# Altium schematic sheet Communications_Module.SchDoc: Communications Modules
size A3; DrawnBy: Igor Bubanja, Tim Oorschot; Organization: Group 7; Address1: ECE Department; Address2: University of Canterbury; Address3: Christchurch 8041; Address4: New Zealand; Revision: 1; SheetNumber: 3; SheetTotal: 3
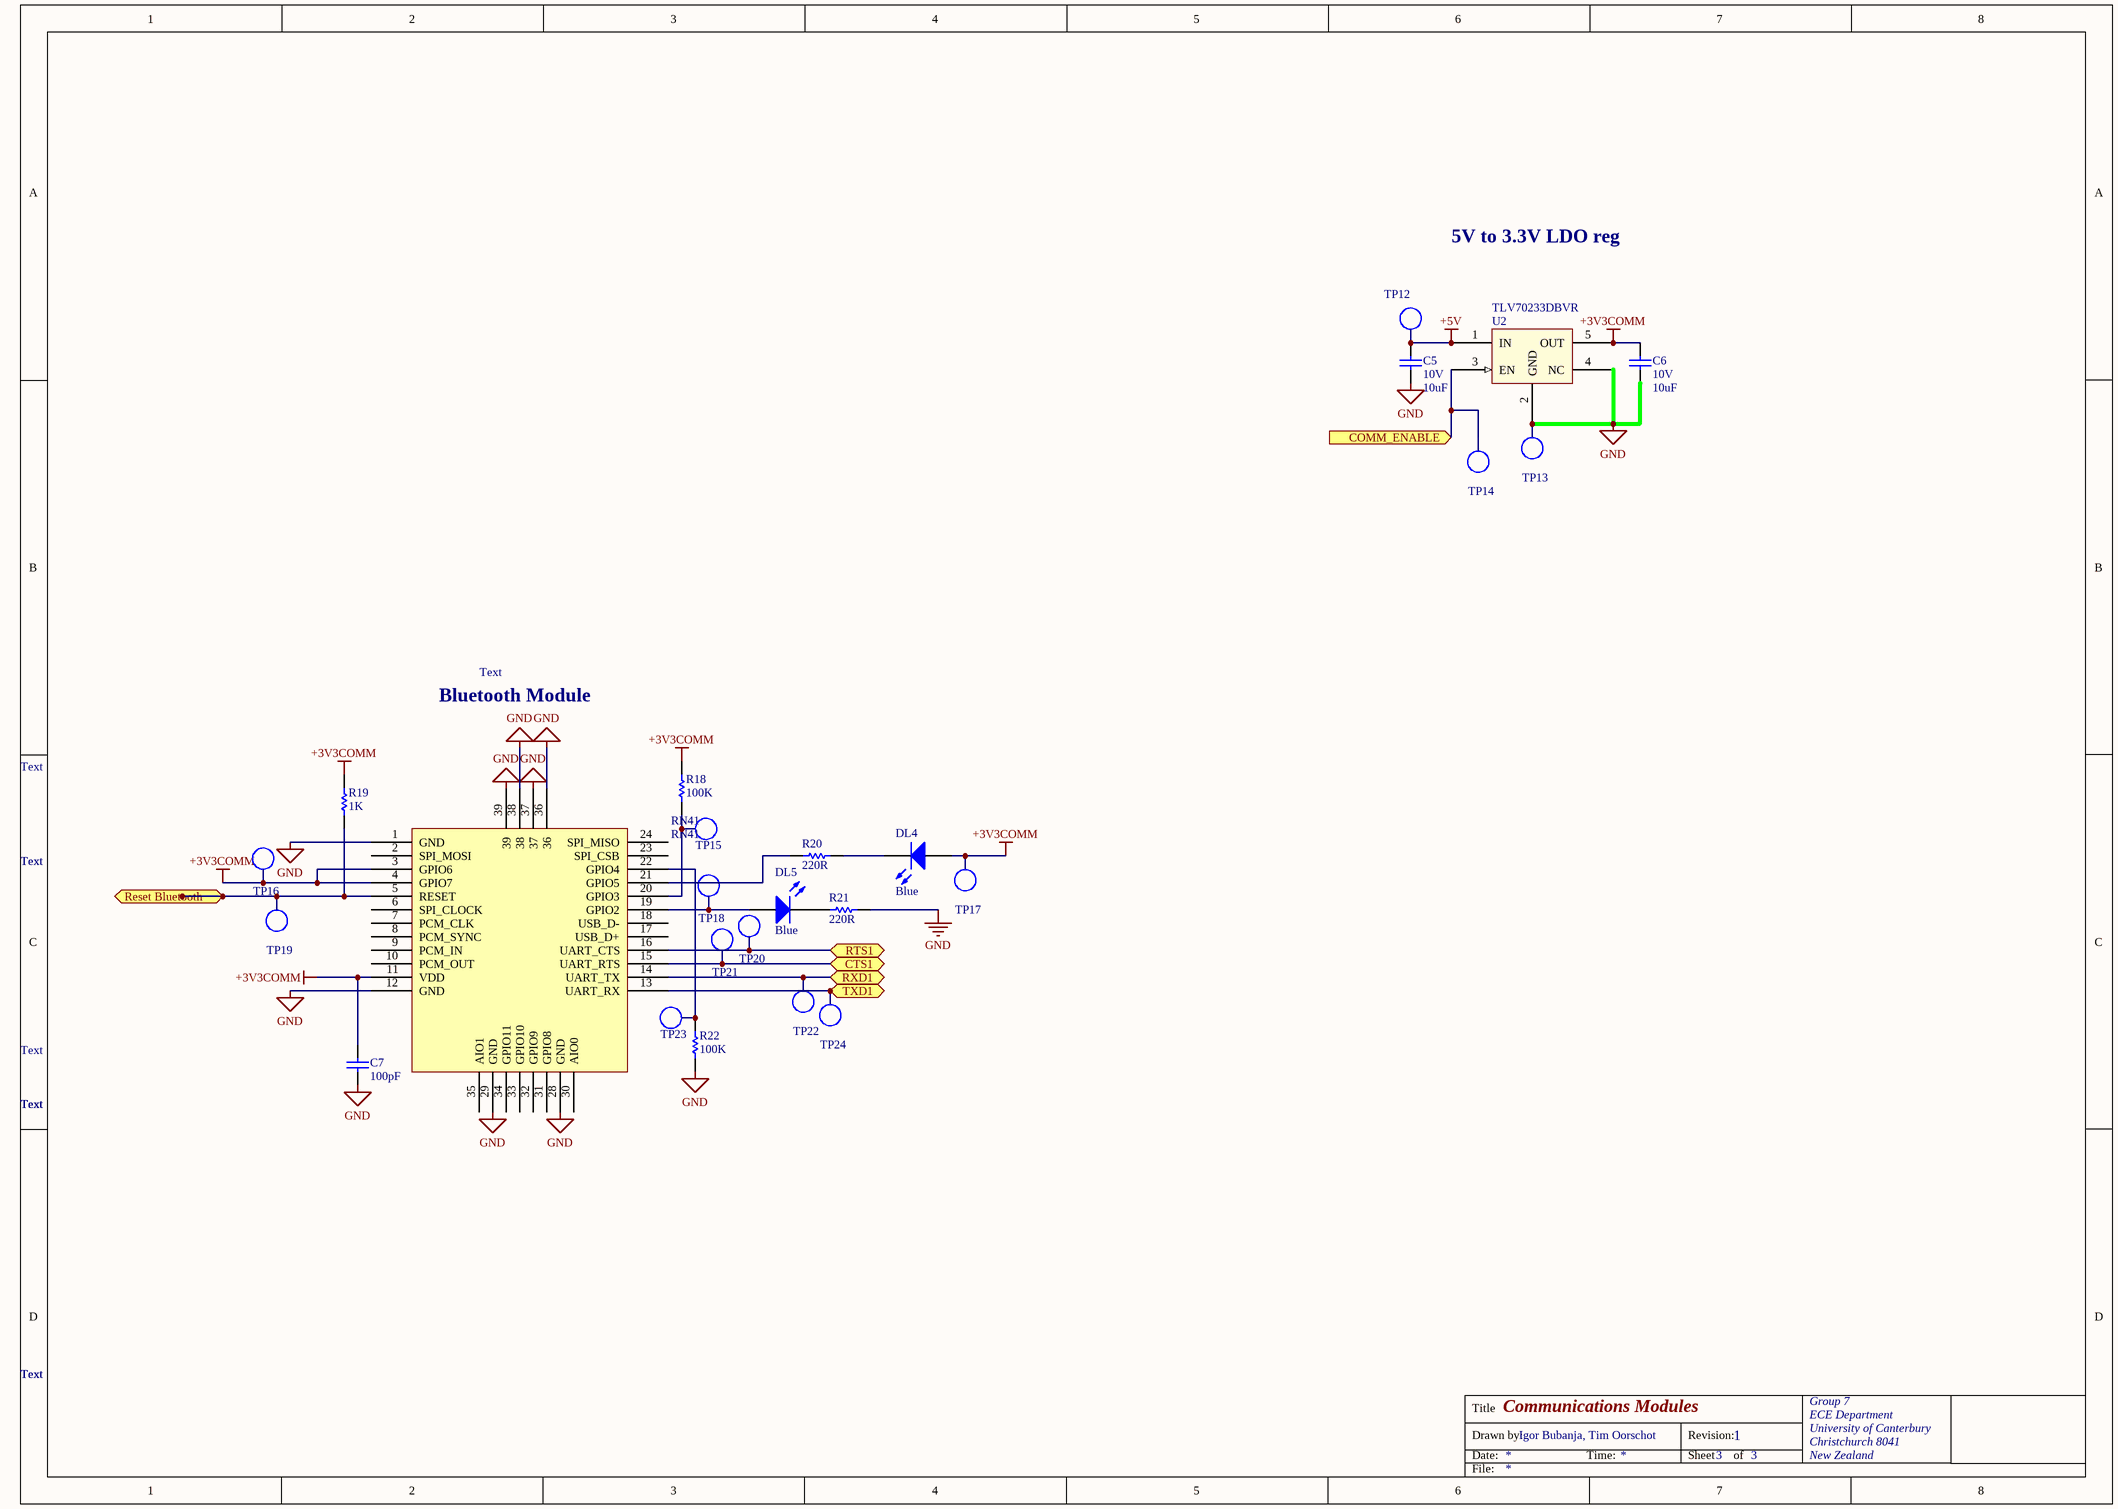
[diagram p0: Communications_Module.SchDoc]

## Parts
C5  Voltage - Rated: 10V  [CAPC1608L]  (hidden comment: 10uF)
C6  Voltage - Rated: 10V  [CAPC1608L]  (hidden comment: 10uF)
C7  100pF  [CAPC1608L]
DL4  Blue  [WL-SMCW0603]
DL5  Blue  [WL-SMCW0603]
R18  100K  [RESC1608L]
R19  1K  [RESC1608L]
R20  220R  [RESC1608L]
R21  220R  [RESC1608L]
R22  100K  [RESC1608L]
RN41  RN41  [PCBComponent_1]
TP12  V_Bus  [TP_0805]  (value not drawn)
TP13  Gnd  [TP_0805]  (value not drawn)
TP14  Gnd  [TP_0805]  (value not drawn)
TP15  Gnd  [TP_0805]  (value not drawn)
TP16  Gnd  [TP_0805]  (value not drawn)
TP17  Gnd  [TP_0805]  (value not drawn)
TP18  Gnd  [TP_0805]  (value not drawn)
TP19  Gnd  [TP_0805]  (value not drawn)
TP20  Gnd  [TP_0805]  (value not drawn)
TP21  Gnd  [TP_0805]  (value not drawn)
TP22  Gnd  [TP_0805]  (value not drawn)
TP23  Gnd  [TP_0805]  (value not drawn)
TP24  Gnd  [TP_0805]  (value not drawn)
U2  TLV70233DBVR  [SOT95P280X145-5N]

## Ports
COMM_ENABLE (in), CTS1, Reset Bluetooth, RTS1, RXD1, TXD1

## Nets
+3V3COMM: C6.1 C7.2 DL4.2(A) R18.2 R19.2 RN41.3(GPIO6) RN41.4(GPIO7) RN41.11(VDD) TP16.1(TP) TP17.1(TP) U2.5(OUT)
+5V: C5.1 TP12.1(TP) U2.1(IN)
GND: C5.2 C6.2 C7.1 R21.2 R22.1 RN41.1(GND) RN41.12(GND) RN41.28(GND) RN41.29(GND) RN41.36 RN41.37 RN41.38 RN41.39 TP13.1(TP) U2.2(GND) U2.4(NC)
COMM_ENABLE: TP14.1(TP) U2.3(EN) ; port COMM_ENABLE
CTS1: RN41.15(UART_RTS) TP21.1(TP) ; port CTS1
Reset Bluetooth: R19.1 RN41.5(RESET) TP19.1(TP) ; port Reset Bluetooth
RTS1: RN41.16(UART_CTS) TP20.1(TP) ; port RTS1
RXD1: RN41.14(UART_TX) TP22.1(TP) ; port RXD1
TXD1: RN41.13(UART_RX) TP24.1(TP) ; port TXD1
NetDL4_1: DL4.1(K) R20.2
NetDL5_1: DL5.1(K) R21.1
NetDL5_2: DL5.2(A) RN41.19(GPIO2) TP18.1(TP)
NetR18_1: R18.1 RN41.20(GPIO3) TP15.1(TP)
NetR20_1: R20.1 RN41.21(GPIO5)
NetR22_2: R22.2 RN41.22(GPIO4) TP23.1(TP)

Not connected (* = marked no-connect by the designer): RN41 2(SPI_MOSI) 6(SPI_CLOCK) 7(PCM_CLK) 8(PCM_SYNC) 9(PCM_IN) 10(PCM_OUT) 17(USB_D+) 18(USB_D-) 23(SPI_CSB) 24(SPI_MISO) 30(AIO0) 31(GPIO8) 32(GPIO9) 33(GPIO10) 34(GPIO11) 35(AIO1)

## Notes on the sheet
- 5V to 3.3V LDO reg
- Bluetooth Module
- Text
- Title
- Drawn by:
- Date:
- Time:
- Revision:
- Sheet
- of
- File:

## Library data of the parts
C5 C6 = CC_10uF_0603: CAP CER 10UF X5R +-20% 10V 0603; Supplier: ECE Dept; Storage Location: PCB Assembly WS; Value: 10uF
C7 = CC_100pF_0603: CAP CER 100pF NPO/COG +-5% 50V 0603; PackageReference: 0603; Code_IPC: 1608 [0603]; Verify: *; Supplier: ECE Dept; Storage Location: PCB Assembly WS; Value: 100pF
DL4 DL5 = DL_150060BS75000: LED Blue 270mcd 0603 SMD; Manufacturer: WURTH ELEKTRONIK; Forward Current If: 30; Forward Voltage: 3.2; Luminous Intensity: 270; Viewing Angle: 120°; Wavelength Typ: 470; Pricing: 1=0.3844, 50=0.3252, 100=0.2957, 500=0.2365 (NZD); Supplier 1: Farnell; Supplier Part Number 1: 2322069; Manufacturer Part Number: 150060BS75000; Storage Location: PCB Assembly WS; Supplier: ECE Dept; LED Colour: Blue
R18 R22 = RS_100K: RES 100K OHM 1/10W 5% 0603 SMD; Storage Location: PCB Assembly WS; Supplier: ECE Dept; Value: 100K
R19 = RS_1K: RES 1.0K OHM 1/10W 5% 0603 SMD; Storage Location: PCB Assembly WS; Supplier: ECE Dept; Value: 1K
R20 R21 = RS_220R: RES 220 OHM 1/10W 5% 0603 SMD; Storage Location: PCB Assembly WS; Supplier: ECE Dept; Value: 220R
RN41 = RN41: Bluetooth RN41
TP12-TP24 = TP_0805: Test Point 2.0X0.9X1.2mm SMD; Manufacturer: TE Connectivity AMP Connectors; Manufacturer Part Number: 1625854-2; Supplier 1: Digi-Key; Mounting Type: Surface Mount; Terminal: 0.079" x 0.049" x 0.057" (2.00mm x 1.25mm x 1.45mm); Type: PC Test Point; Supplier Part Number 1: A106144CT-ND
U2 = SV_TLV70233DBVR: IC REG LDO 3.3V 0.3A SOT23-5; Manufacturer: Texas Instruments; Current - Output: 300mA; Supplier 1: Digi-Key; Operating Temperature: -40°C ~ 125°C; Package / Case: SC-74A, SOT-753; Pricing: 1=0.77, 10=0.647, 25=0.5672, 100=0.4853, 250=0.421, 500=0.35658, 750=0.30789, 1000=0.2749 (NZD); Supplier Part Number 1: 296-32415-1-ND; Manufacturer Part Number: TLV70233DBVR